# Altium schematic sheet auto_threader.SchDoc (part 1 of 3)
size A4; SheetNumber: 1; SheetTotal: 1
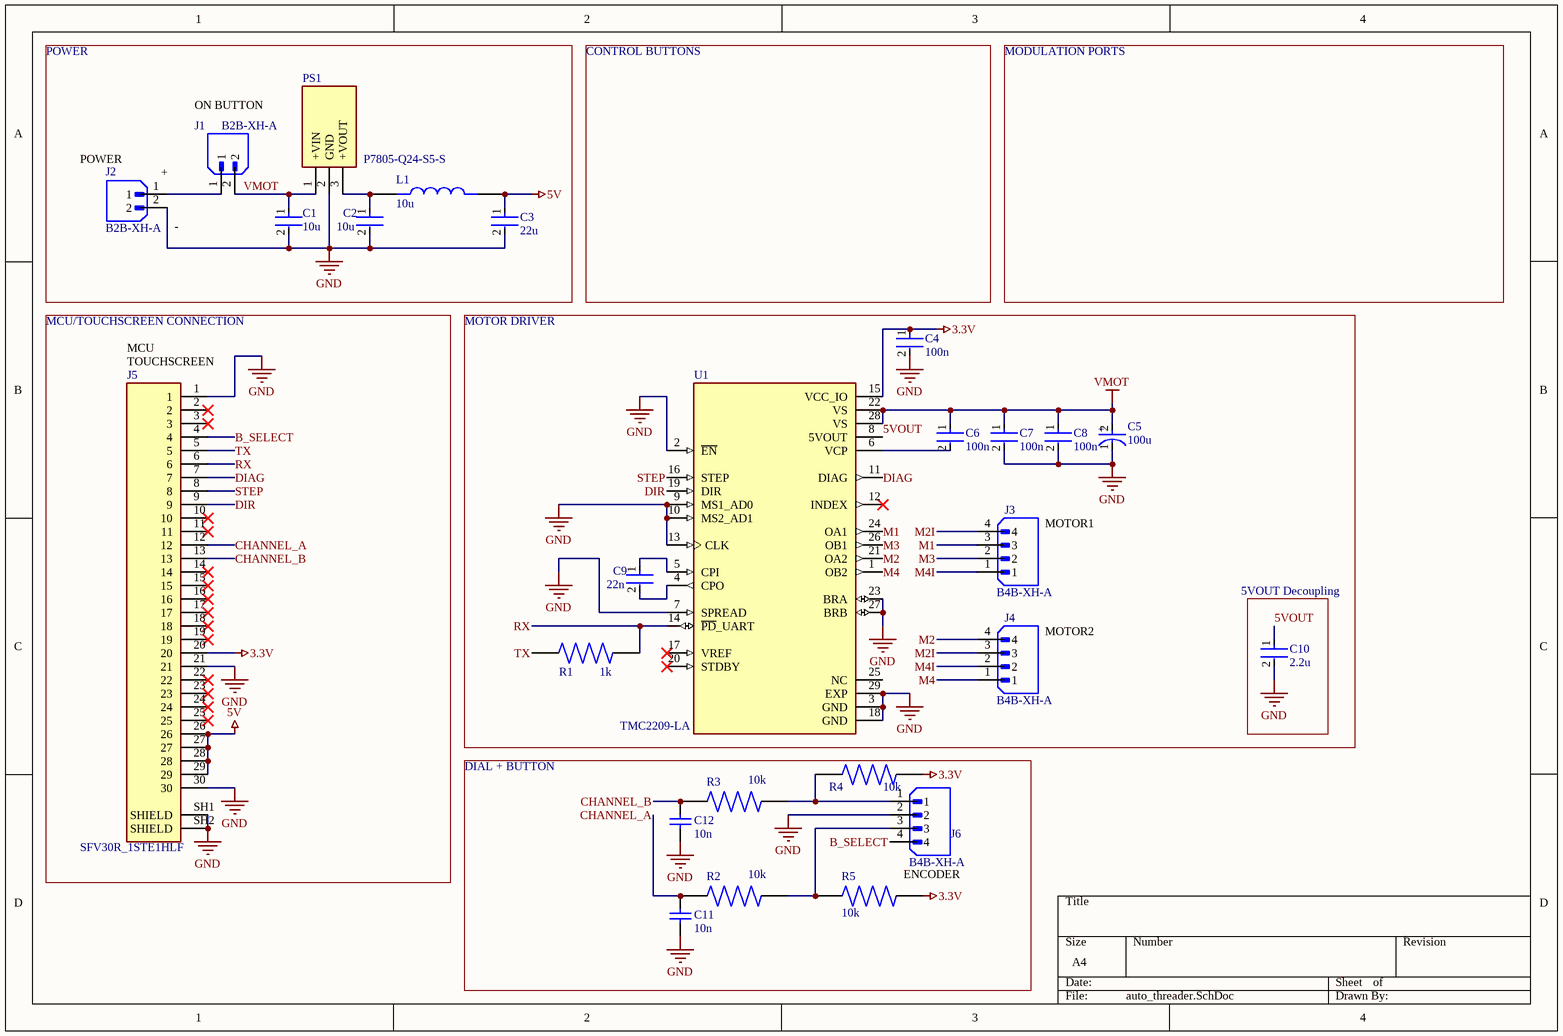
[diagram p0: auto_threader.SchDoc]

## Parts
C1  10u  [GRM21BR61H106KE43L]
C2  10u  [GRM21BR71A106KA73L]
C3  22u  [GRM188R61A226ME15D]
C4  100n  [CC0805KRX7R9BB104]
C5  100u  [35ZLH100MEFC6.3X11]
C6  100n  [CC0805KRX7R9BB104]
C7  100n  [CC0805KRX7R9BB104]
C8  100n  [CC0805KRX7R9BB104]
C9  22n  [CC0603KRX7R9BB223]
C10  2.2u  [GRM155C80J225KE95D]
C11  10n  [GCM188R71H103KA37D]
C12  10n  [GCM188R71H103KA37D]
J1  B2B-XH-A  [B2B-XH-A]
J2  B2B-XH-A  [B2B-XH-A]
J3  B4B-XH-A  [B4B-XH-A]
J4  B4B-XH-A  [B4B-XH-A]
J5  SFV30R_1STE1HLF  [SFV30R-1STE1HLF]
J6  B4B-XH-A  [B4B-XH-A]
L1  10u  [SRP4020TA-100M]
PS1  P7805-Q24-S5-S  [P7805-Q24-S5-S]
R1  1k  [RC0805FR-071KL]
R2  10k  [RC0805FR-0710KL]
R3  10k  [RC0805FR-0710KL]
R4  10k  [RC0805FR-0710KL]
R5  10k  [RC0805FR-0710KL]
U1  TMC2209-LA  [TMC2209-LA]

## Nets
3.3V: C4.1 J5.20 R4.2 R5.2 U1.15(VCC_IO)
5V: C3.1 J5.26 J5.27 J5.28 J5.29 L1.2
GND: C1.2 C2.2 C3.2 C4.2 C5.1(C) C7.2 C8.2 C10.2 C11.2 C12.2 J2.2 J5.1 J5.21 J5.30 J5.SH1(SHIELD) J5.SH2(SHIELD) J6.2 PS1.2(GND) U1.2(~{EN}) U1.3(GND) U1.7(SPREAD) U1.9(MS1_AD0) U1.10(MS2_AD1) U1.13(CLK) U1.18(GND) U1.23(BRA) U1.27(BRB) U1.29(EXP)
VMOT: C1.1 C5.2(A) C6.1 C7.1 C8.1 J1.2 PS1.1(+VIN) U1.22(VS) U1.28(VS)
5VOUT: C10.1 U1.8(5VOUT)
B_SELECT: J5.4 J6.4
CHANNEL_A: C11.1 J5.12 R2.1
CHANNEL_B: C12.1 J5.13 R3.1
DIAG: J5.7 U1.11(DIAG)
DIR: J5.9 U1.19(DIR)
M1: J3.3 U1.24(OA1)
M2: J4.4 U1.21(OA2)
M2I: J3.4 J4.3
M3: J3.2 U1.26(OB1)
M4: J4.1 U1.1(OB2)
M4I: J3.1 J4.2
RX: J5.6 R1.2 U1.14(~{PD}_UART)
STEP: J5.8 U1.16(STEP)
TX: J5.5 R1.1
NetC2_1: C2.1 L1.1 PS1.3(+VOUT)
NetC6_2: C6.2 U1.6(VCP)
NetC9_1: C9.1 U1.5(CPI)
NetC9_2: C9.2 U1.4(CPO)
NetJ1_1: J1.1 J2.1
NetJ6_1: J6.1 R3.2 R4.1
NetJ6_3: J6.3 R2.2 R5.1

Not connected (* = marked no-connect by the designer): J5 2* 3* 10* 11* 14* 15* 16* 17* 18* 19* 22* 23* 24* 25*; U1 12(INDEX)* 17(VREF)* 20(STDBY)* 25(NC)

## Notes on the sheet
- POWER
- ON BUTTON
- CONTROL BUTTONS
- MODULATION PORTS
- (near J2) POWER
- (near J2) +
- (near J2) -
- MCU/TOUCHSCREEN CONNECTION
- (near J5) TOUCHSCREEN
- MCU
- MOTOR DRIVER
- (near J3) MOTOR1
- (near J4) MOTOR2
- (near C10) 5VOUT Decoupling
- DIAL + BUTTON
- (near R5) ENCODER
- (in symbol 35ZLH100MEFC6.3X11) +